# EAGLE design me433.2 (EAGLE 9.6.2)
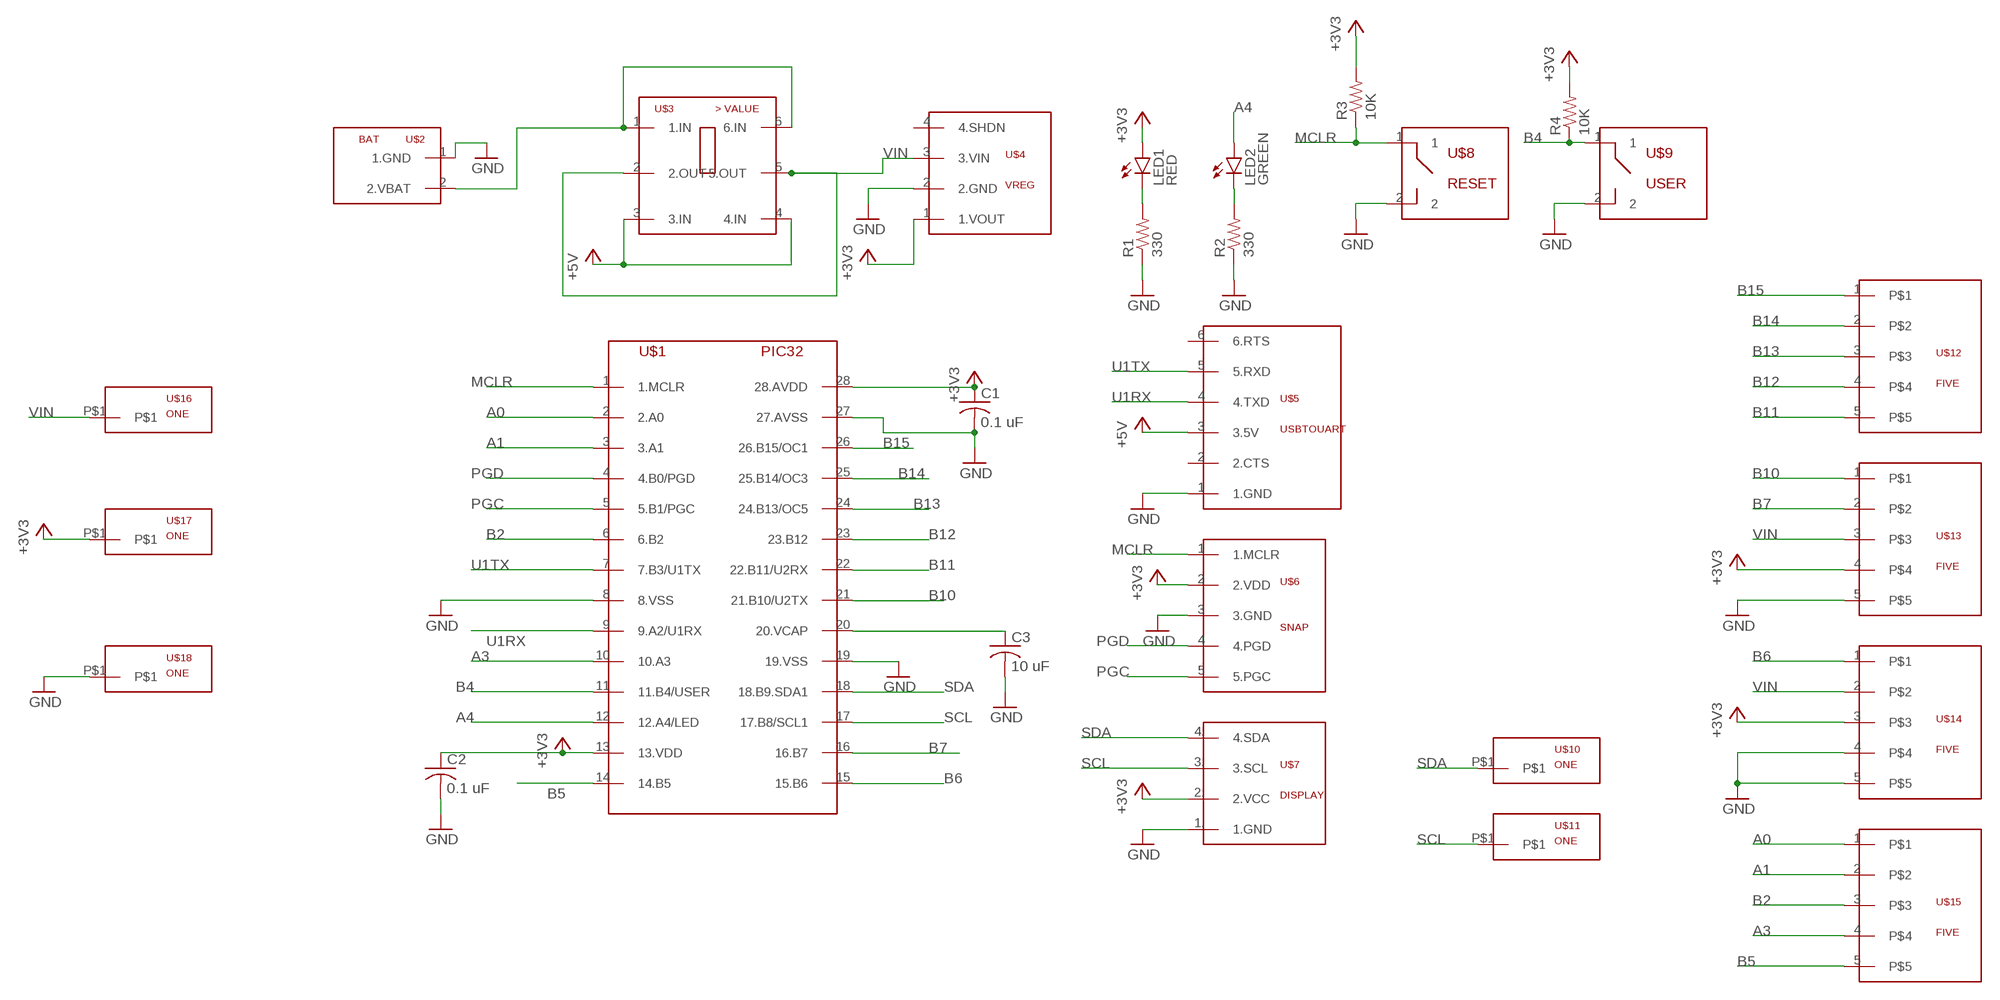
[diagram p0: schematic, sheet 1]

## Parts
C1  0.1 uF  C-US025-024X044  [C025-024X044]
C2  0.1 uF  C-US025-024X044  [C025-024X044]
C3  10 uF  C-US025-024X044  [C025-024X044]
LED1  RED  LED3MM  [LED3MM]
LED2  GREEN  LED3MM  [LED3MM]
R1  330  R-US_0207/7  [0207/7]
R2  330  R-US_0207/7  [0207/7]
R3  10K  R-US_0207/7  [0207/7]
R4  10K  R-US_0207/7  [0207/7]
U$1  PIC32  [DIL28-3]
U$2  BAT  [BAT]
U$3  SLIDE  [SLIDE]
U$4  VREG  [VREG]
U$5  USBTOUART  [USBTOUART]
U$6  SNAP  [SNAP]
U$7  DISPLAY  [DISPLAY]
U$8  RESET  BUTTON  [BUTTON]
U$9  USER  BUTTON  [BUTTON]
U$10  ONE  [ONE]
U$11  ONE  [ONE]
U$12  FIVE  [FIVE]
U$13  FIVE  [FIVE]
U$14  FIVE  [FIVE]
U$15  FIVE  [FIVE]
U$16  ONE  [ONE]
U$17  ONE  [ONE]
U$18  ONE  [ONE]

## Nets
+3V3: C1.1 C2.1 LED1.A R3.2 R4.2 U$1.13(13.VDD) U$1.28(28.AVDD) U$4.1(1.VOUT) U$6.2(2.VDD) U$7.2.(2.VCC) U$13.4 U$14.3 U$17.P$1
+5V: U$3.3(3.IN) U$3.4(4.IN) U$5.3(3.5V)
A0: U$1.2(2.A0) U$15.1
A1: U$1.3(3.A1) U$15.2
A3: U$1.10(10.A3) U$15.4
A4: LED2.A U$1.12(12.A4/LED)
B2: U$1.6(6.B2) U$15.3
B4: R4.1 U$1.11(11.B4/USER) U$9.1
B5: U$1.14(14.B5) U$15.5
B6: U$1.15(15.B6) U$14.1
B7: U$1.16(16.B7) U$13.2
B10: U$1.21(21.B10/U2TX) U$13.1
B11: U$1.22(22.B11/U2RX) U$12.5
B12: U$1.23(23.B12) U$12.4
B13: U$1.24(24.B13/OC5) U$12.3
B14: U$1.25(25.B14/OC3) U$12.2
B15: U$1.26(26.B15/OC1) U$12.1
GND: C1.2 C2.2 C3.2 R1.1 R2.1 U$1.8(8.VSS) U$1.19(19.VSS) U$1.27(27.AVSS) U$2.1(1.GND) U$4.2(2.GND) U$5.1(1.GND) U$6.3(3.GND) U$7.1.(1.GND) U$8.2 U$9.2 U$13.5 U$14.4 U$14.5 U$18.P$1
MCLR: R3.1 U$1.1(1.MCLR) U$6.1(1.MCLR) U$8.1
N$1: U$2.2(2.VBAT) U$3.1(1.IN) U$3.6(6.IN)
N$2: LED1.K(C) R1.2
N$5: C3.1 U$1.20(20.VCAP)
N$6: LED2.K(C) R2.2
PGC: U$1.5(5.B1/PGC) U$6.5(5.PGC)
PGD: U$1.4(4.B0/PGD) U$6.4(4.PGD)
SCL: U$1.17(17.B8/SCL1) U$7.3.(3.SCL) U$11.P$1
SDA: U$1.18(18.B9.SDA1) U$7.4.(4.SDA) U$10.P$1
U1RX: U$1.9(9.A2/U1RX) U$5.4(4.TXD)
U1TX: U$1.7(7.B3/U1TX) U$5.5(5.RXD)
VIN: U$3.2(2.OUT) U$3.5(5.OUT) U$4.3(3.VIN) U$13.3 U$14.2 U$16.P$1
Unconnected: U$4.4(4.SHDN) U$5.2(2.CTS) U$5.6(6.RTS)

## Library data of the parts
C1-C3 = ME433PIC32:C-US: CAPACITOR, American symbol; SPICEPREFIX: C
LED1 LED2 = ME433PIC32:LED: LED OSRAM: - CHIPLED LG R971, LG N971, LY N971, LG Q971, LY Q971, LO R971, LY R971 LH N974, LH R974 LS Q976, LO Q976, LY Q976 LO Q996 - Hyper CHIPLED LW Q18S LB Q993, LB Q99A, LB R99A - SideLED LS A670, LO A670, LY A670, LG A670, LP A670 LB A673, LV A673, LT A673, LW A673 LH A674 LY A675 LS A676, LA A676, LO A676, LY A676, LW A676 LS A679, LY A679, LG A679 - Hyper Micro SIDELED® LS Y876, LA Y876, LO Y876, LY Y876 LT Y87S - SmartLED LW L88C, LW L88S LB L89C, LB L89S, LG L890 LS L89K, LO L89K, LY L89K LS L896, LA L896, LO L896, LY L896 - TOPLED LS T670, LO T670, LY T670, LG T670, LP T670 LSG T670, LSP T670, LSY T670, LOP T670, LYG T670 LG T671, LOG T671, LSG T671 LB T673, LV T673, LT T673, LW T673 LH T674 LS T676, LA T676, LO T676, LY T676, LB T676, LH T676, LSB T676, LW T676 LB T67C, LV T67C, LT T67C, LS T67K, LO T67K, LY T67K, LW E67C LS E67B, LA E67B, LO E67B, LY E67B, LB E67C, LV E67C, LT E67C LW T67C LS T679, LY T679, LG T679 LS T770, LO T770, LY T770, LG T770, LP T770 LB T773, LV T773, LT T773, LW T773 LH T774 LS E675, LA E675, LY E675, LS T675 LS T776, LA T776, LO T776, LY T776, LB T776 LHGB T686 LT T68C, LB T68C - Hyper Mini TOPLED® LB M676 - Mini TOPLED Santana® LG M470 LS M47K, LO M47K, LY M47K Source: http://www.osram.convergy.de LUXEON: - LUMILED® LXK2-PW12-R00, LXK2-PW12-S00, LXK2-PW14-U00, LXK2-PW14-V00 LXK2-PM12-R00, LXK2-PM12-S00, LXK2-PM14-U00 LXK2-PE12-Q00, LXK2-PE12-R00, LXK2-PE12-S00, LXK2-PE14-T00, LXK2-PE14-U00 LXK2-PB12-K00, LXK2-PB12-L00, LXK2-PB12-M00, LXK2-PB14-N00, LXK2-PB14-P00, LXK2-PB14-Q00 LXK2-PR12-L00, LXK2-PR12-M00, LXK2-PR14-Q00, LXK2-PR14-R00 LXK2-PD12-Q00, LXK2-PD12-R00, LXK2-PD12-S00 LXK2-PH12-R00, LXK2-PH12-S00 LXK2-PL12-P00, LXK2-PL12-Q00, LXK2-PL12-R00 Source: www.luxeon.com KINGBRIGHT: KA-3528ASYC Source: www.kingbright.com
R1-R4 = ME433PIC32:R-US_: RESISTOR, American symbol; SPICEPREFIX: R
U$1 = ME433PIC32:PIC32
U$2 = ME433PIC32:BAT
U$3 = ME433PIC32:SLIDE
U$4 = ME433PIC32:VREG
U$5 = ME433PIC32:USBTOUART
U$6 = ME433PIC32:SNAP
U$7 = ME433PIC32:DISPLAY
U$8 U$9 = ME433PIC32:BUTTON
U$10 U$11 U$16-U$18 = ME433PIC32:ONE
U$12-U$15 = ME433PIC32:FIVE

## Board
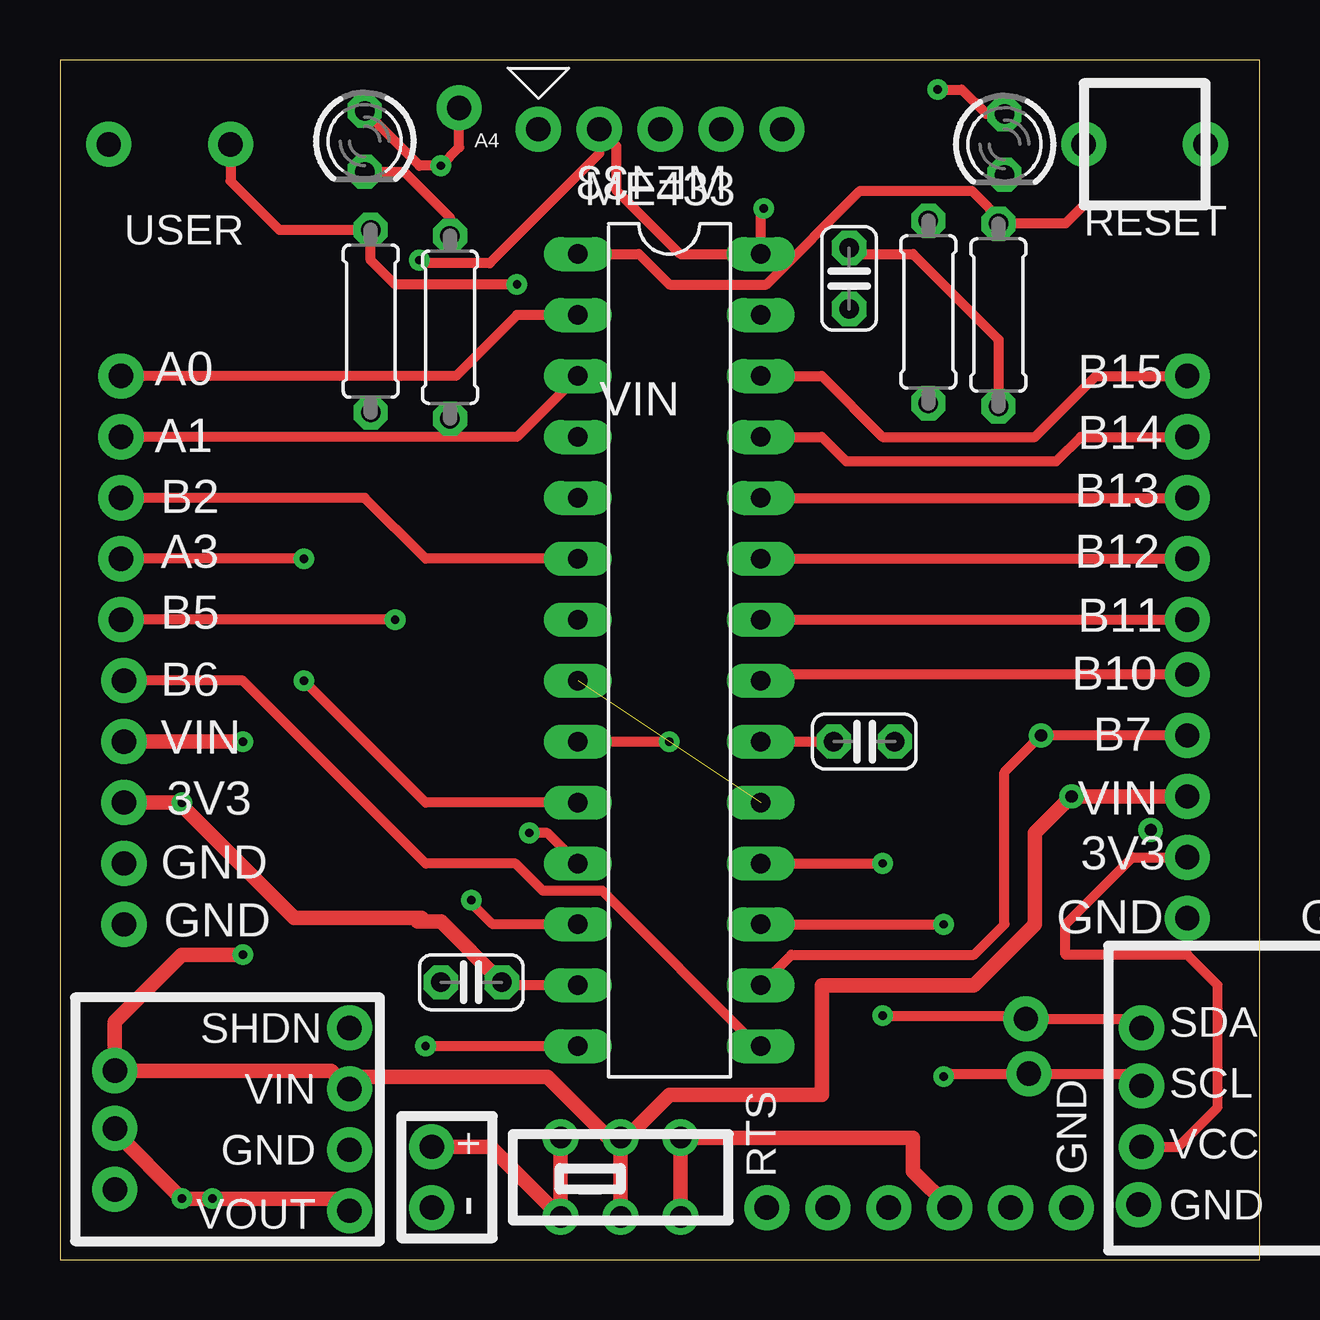
[diagram p1: board, top side]
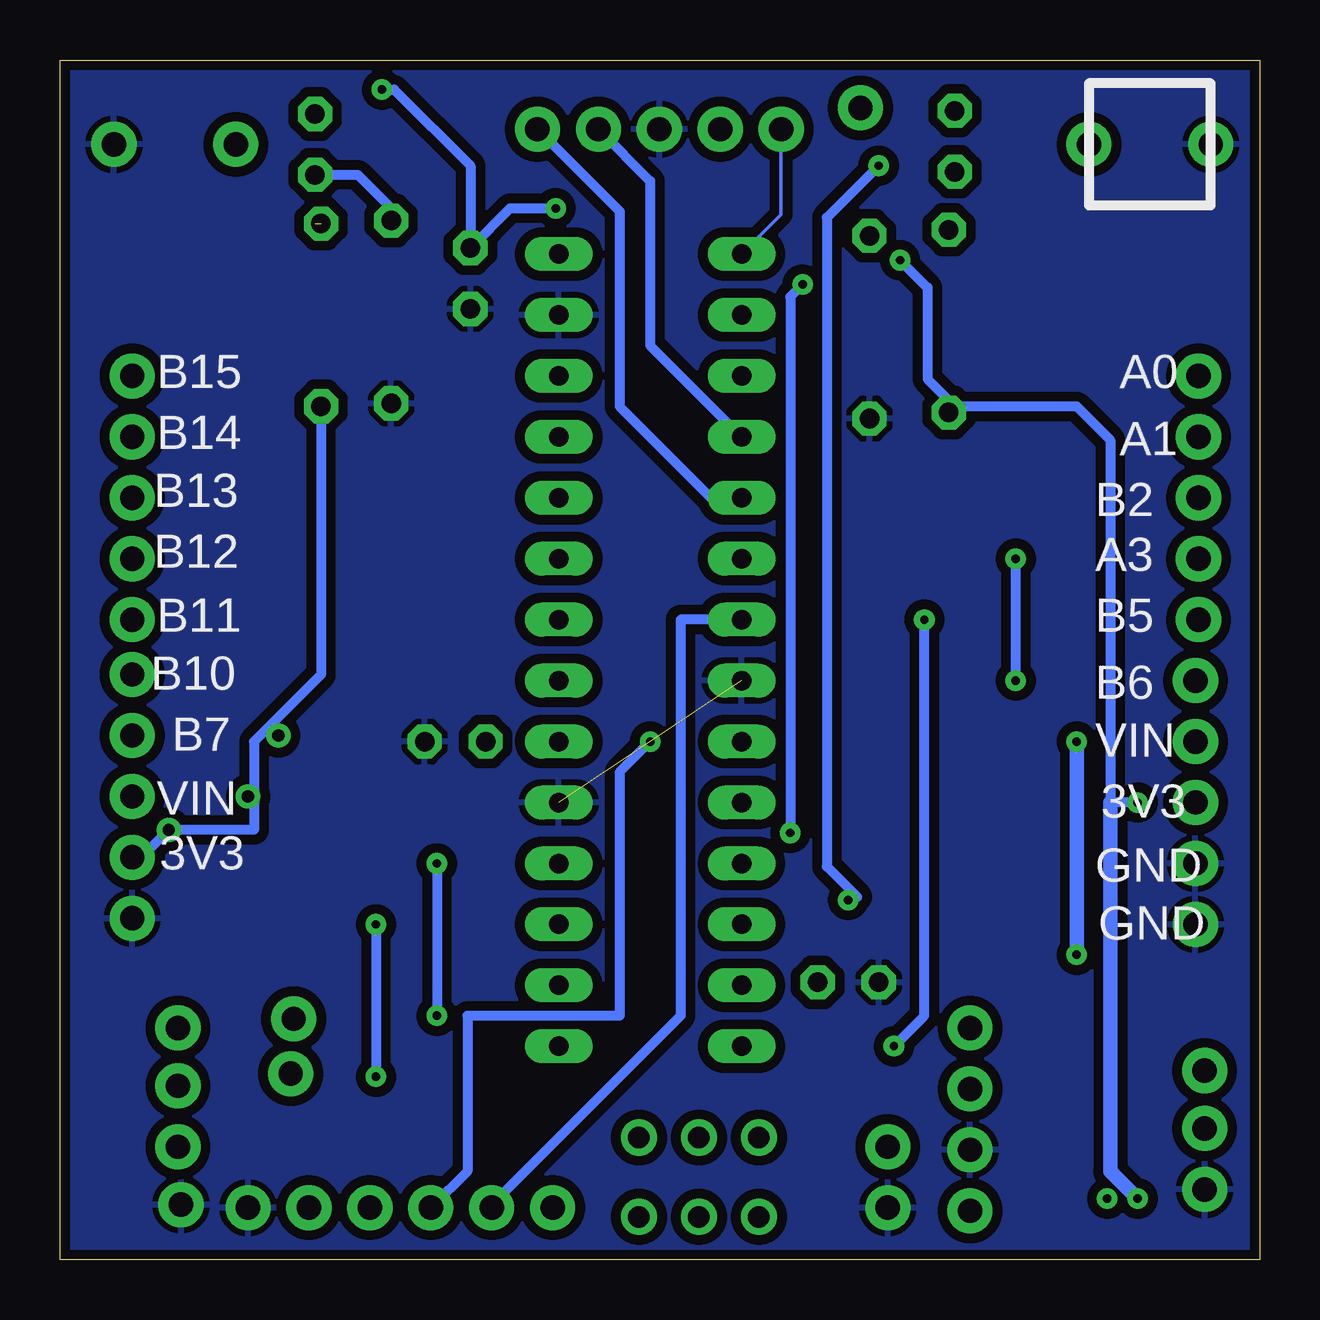
[diagram p2: board, bottom side, seen from below]

Size 50 x 50 mm. Coordinates in mm from the lower left corner, seen from the top.
Outline: 0,0 50,0 50,50 0,50 0,0
Copper layers (1*16): Top 0.035mm / dielectric 1.5mm / Bottom 0.035mm
Design rules "SparkFun": minimum track width 8mil, minimum drill 20mil, track to track 8mil, track to pad 8mil, pad to pad 8mil, via to via 8mil, smd to smd 8mil, copper to edge 8mil, drill to drill 8mil, minimum pad ring 12mil, minimum via ring 10mil, stop-mask expansion 4mil, vias tented up to drill 20mil, thermal gap 10mil

### Footprints (pad centres in the part's own frame; a part is rotated, then mirrored left to right if it is on the bottom)
C025-024X044 = drill 0.813 octagon: 1 -1.27,0; 2 1.27,0
LED3MM = drill 0.813 octagon: A -1.27,0; K 1.27,0
0207/7 = drill 0.813 octagon: 1 -3.81,0; 2 3.81,0
DIL28-3 = drill 0.813 long: 1 -16.51,-3.81; 2 -13.97,-3.81; 3 -11.43,-3.81; 4 -8.89,-3.81; 5 -6.35,-3.81; 6 -3.81,-3.81; 7 -1.27,-3.81; 8 1.27,-3.81; 9 3.81,-3.81; 10 6.35,-3.81; 11 8.89,-3.81; 12 11.43,-3.81; 13 13.97,-3.81; 14 16.51,-3.81; 15 16.51,3.81; 16 13.97,3.81; 17 11.43,3.81; 18 8.89,3.81; 19 6.35,3.81; 20 3.81,3.81; 21 1.27,3.81; 22 -1.27,3.81; 23 -3.81,3.81; 24 -6.35,3.81; 25 -8.89,3.81; 26 -11.43,3.81; 27 -13.97,3.81; 28 -16.51,3.81
BAT = drill 1.016 pad 1.88: 1 -1.27,0; 2 1.27,0
SLIDE = drill 0.9: 1 -2.5,-1.65; 2 0,-1.65; 3 2.5,-1.65; 4 2.5,1.65; 5 0,1.65; 6 -2.5,1.65
VREG = drill 1.016 pad 1.88: 1 -3.81,0; 2 -1.27,0; 3 1.27,0; 4 3.81,0
USBTOUART = drill 1.016 pad 1.88: 1 -6.35,0; 2 -3.81,0; 3 -1.27,0; 4 1.27,0; 5 3.81,0; 6 6.35,0
SNAP = drill 1.016 pad 1.88: 1 -5.08,0; 2 -2.54,0; 3 0,0; 4 2.54,0; 5 5.08,0
DISPLAY = drill 1.016 pad 1.88: 1. 0,-4.445; 2. 0.127,-2.032; 3. 0.127,0.508; 4. 0.127,2.921
BUTTON = drill 1.016 pad 1.88: 1 -2.54,0; 2 2.54,0
ONE = drill 1.016 pad 1.88: P$1 0,0
FIVE = drill 1.016 pad 1.88: 1 -5.08,0; 2 -2.54,0; 3 0,0; 4 2.54,0; 5 5.08,0

### Placement (x,y rotation side)
C1  32.89,40.89 270 top
C2  17.14,11.56 180 top
C3  33.53,21.59 0 top
LED1  39.37,46.48 270 top
LED2  12.7,46.61 270 top
R1  36.2,39.5 90 top
R2  16.26,38.86 90 top
R3  39.12,39.37 270 top
R4  12.95,39.12 270 top
U$1  25.4,25.4 270 top
U$2  15.49,3.43 90 top
U$3  23.37,3.43 0 top
U$4  12.06,5.84 90 top
U$5  35.81,2.16 180 top
U$6  25.02,47.12 0 top
U$7  44.96,6.73 0 top
U$8  45.21,46.48 0 top
U$9  4.57,46.48 0 bottom
U$10  40.26,10.03 0 top
U$11  40.39,7.75 0 top
U$12  46.99,31.75 270 top
U$13  46.99,19.3 270 top
U$14  2.67,19.05 270 top
U$15  2.54,31.75 270 top
U$16  2.29,7.87 0 top
U$17  2.29,5.46 0 top
U$18  2.29,2.92 0 top

### Tracks (layer width: path | path; a pad name or v marks a point on that pad's centre or on a via)
+3V3  (via drill 0.35, 0.51)
  Top 0.406: U$1.13 18.54,11.43 C2.1 | v29.34,43.81 29.21,43.69 U$1.28 25.85,41.91 23.19,44.58 23.19,46.41 U$6.2 22.48,46.1 17.91,41.53 15.11,41.53 v14.99,41.66 | v36.58,48.77 37.59,48.77 38.61,47.75 LED1.A | C1.1 33.15,41.91 35.56,41.91 39.12,38.35 R3.2 | U$7.2. 46.61,4.7 48.26,6.35 48.26,11.43 46.99,12.7 41.91,12.7 41.91,13.97 44.7,16.76 U$13.4
  Top 0.61: U$4.1 11.56,2.54 v6.35,2.54 v5.08,2.54 2.29,5.33 U$17.P$1 | U$14.3 v5.08,19.05 4.95,19.05 9.75,14.25 15.07,14.25 14.92,14.1 15.88,14.1 C2.1
  Bottom 0.406: v29.34,43.81 31.24,43.81 C1.1 32.89,45.59 36.07,48.77 v36.58,48.77 | v5.08,19.05 6.22,19.05 6.22,34.16 7.62,35.56 12.7,35.56 | 12.7,35.56 R4.2 | R3.2 39.12,24.38 41.91,21.59 41.91,17.91 v45.47,17.91 46.86,16.51 46.86,16.89 U$13.4 | v14.99,41.66 13.84,40.51 13.84,36.7 12.7,35.56
  Bottom 0.61: 6.22,19.05 6.22,3.68 v5.08,2.54
+5V
  Top 0.61: U$3.3 U$3.4 35.56,5.08 35.56,3.68 U$5.3
A0
  Top 0.406: U$1.2 19.05,39.37 16.51,36.83 U$15.1
A1
  Top 0.406: U$1.3 19.05,34.29 U$15.2
A3  (via drill 0.35)
  Top 0.406: U$1.10 15.24,19.05 v10.16,24.13 | v10.16,29.21 U$15.4
  Bottom 0.406: v10.16,24.13 v10.16,29.21
A4  (via drill 0.35, 1.02 pad 1.88)
  Top 0.406: U$1.12 18.03,13.97 17.14,14.86 v17.14,14.99 | LED2.A 14.99,45.59 v15.88,45.59 16.64,46.35 v16.64,48.01
  Bottom 0.406: v17.14,14.99 17.02,15.11 16.76,15.11 18.03,16.38 18.03,43.43 v15.88,45.59
B2
  Top 0.406: U$1.6 15.24,29.21 12.7,31.75 U$15.3
B4  (via drill 0.35)
  Top 0.406: U$9.1 7.11,44.96 9.14,42.93 R4.1 12.95,41.66 13.97,40.64 v19.05,40.64 | U$1.11 20.32,17.78 v19.56,17.78
  Bottom 0.406: v19.56,17.78 19.56,40.13 v19.05,40.64
B5  (via drill 0.35)
  Top 0.406: U$1.14 v15.24,8.89 | v13.97,26.67 U$15.5
  Bottom 0.406: v15.24,8.89 13.97,10.16 v13.97,26.67
B6
  Top 0.406: U$1.15 29.08,8.89 22.61,15.37 20.13,15.37 18.98,16.51 15.24,16.51 7.62,24.13 U$14.1
B7  (via drill 0.51)
  Top 0.406: U$1.16 30.48,12.7 38.1,12.7 39.37,13.97 39.37,20.32 v40.89,21.84 U$13.2
B10  (via drill 0.51)
  Top 0.406: U$1.21 29.46,24.38 U$13.1
  other vias: 46.99,24.38
B11
  Top 0.406: U$1.22 U$12.5
B12
  Top 0.406: U$1.23 U$12.4
B13
  Top 0.406: U$1.24 U$12.3
B14
  Top 0.406: U$1.25 31.75,34.29 32.77,33.27 41.53,33.27 42.55,34.29 U$12.2
B15
  Top 0.406: U$1.26 31.75,36.83 34.29,34.29 40.64,34.29 43.18,36.83 U$12.1
GND  (1 unrouted)
  pour Bottom (isolate 0.406): 0,0 50.8,0 50.8,50.8 0,50.8
MCLR  (1 unrouted)
  Top 0.406: U$8.1 42.67,43.94 41.91,43.18 R3.1 | U$1.1 24.13,41.91 25.4,40.64 29.44,40.64 33.35,44.55 38,44.55 39.37,43.18
  Bottom 0.152: U$6.1 19.94,43.56 U$1.1
N$1
  Top 0.61: U$3.6 U$3.1 17.95,4.7 U$2.2
N$2
  Bottom 0.406: LED1.K 37.59,45.21 36.2,43.81 R1.2
N$5
  Top 0.406: U$1.20 C3.1
N$6
  Top 0.406: LED2.K 14.35,45.34 16.26,43.43 R2.2
PGC
  Bottom 0.406: U$6.5 26.67,43.69 26.67,35.56 22.86,31.75 U$1.5
PGD
  Bottom 0.406: U$6.4 25.4,44.96 25.4,38.1 U$1.4
SCL  (via drill 0.35)
  Top 0.406: U$1.17 v36.83,13.97 | v36.83,7.62 36.96,7.75 U$11.P$1 44.58,7.75 U$7.3.
  Bottom 0.406: v36.83,13.97 v36.83,7.62
SDA  (via drill 0.35)
  Top 0.406: U$1.18 v34.29,16.51 | v34.29,10.16 40.13,10.16 U$10.P$1 44.7,10.03 U$7.4.
  Bottom 0.406: v34.29,16.51 v34.29,10.16
U1RX  (via drill 0.35)
  Top 0.406: U$1.9 v25.4,21.59
  Bottom 0.406: v25.4,21.59 26.67,20.32 26.67,10.16 33.02,10.16 33.02,3.68 U$5.4
U1TX
  Bottom 0.406: U$1.7 24.13,26.67 24.13,10.16 32,2.29 U$5.5
VIN  (via drill 0.35, 0.51)
  Top 0.61: U$3.5 U$3.2 | U$3.5 22.86,5.08 20.32,7.62 12.06,7.62 U$4.3 11.3,7.87 U$16.P$1 2.29,9.91 5.08,12.7 v7.62,12.7 | U$3.5 23.62,5.08 25.4,6.86 31.75,6.86 31.75,11.43 38.1,11.43 40.64,13.97 40.64,17.78 v42.16,19.3 U$13.3 | U$14.2 v7.62,21.59
  Bottom 0.61: v7.62,21.59 v7.62,12.7

### Text on the board
tPlace: A4 | ME433 | ME433 | A0 | B15 | VIN | A1 | B14 | B2 | B13 | A3 | B12 | B5 | B11 | B11 | B10 | B6 | VIN | B7 | 3V3 | VIN | GND | 3V3 | GND | GND | GND
bPlace: A0 | B15 | A1 | B14 | B2 | B13 | A3 | B12 | B5 | B11 | B10 | B6 | VIN | B7 | VIN | 3V3 | GND | 3V3 | GND